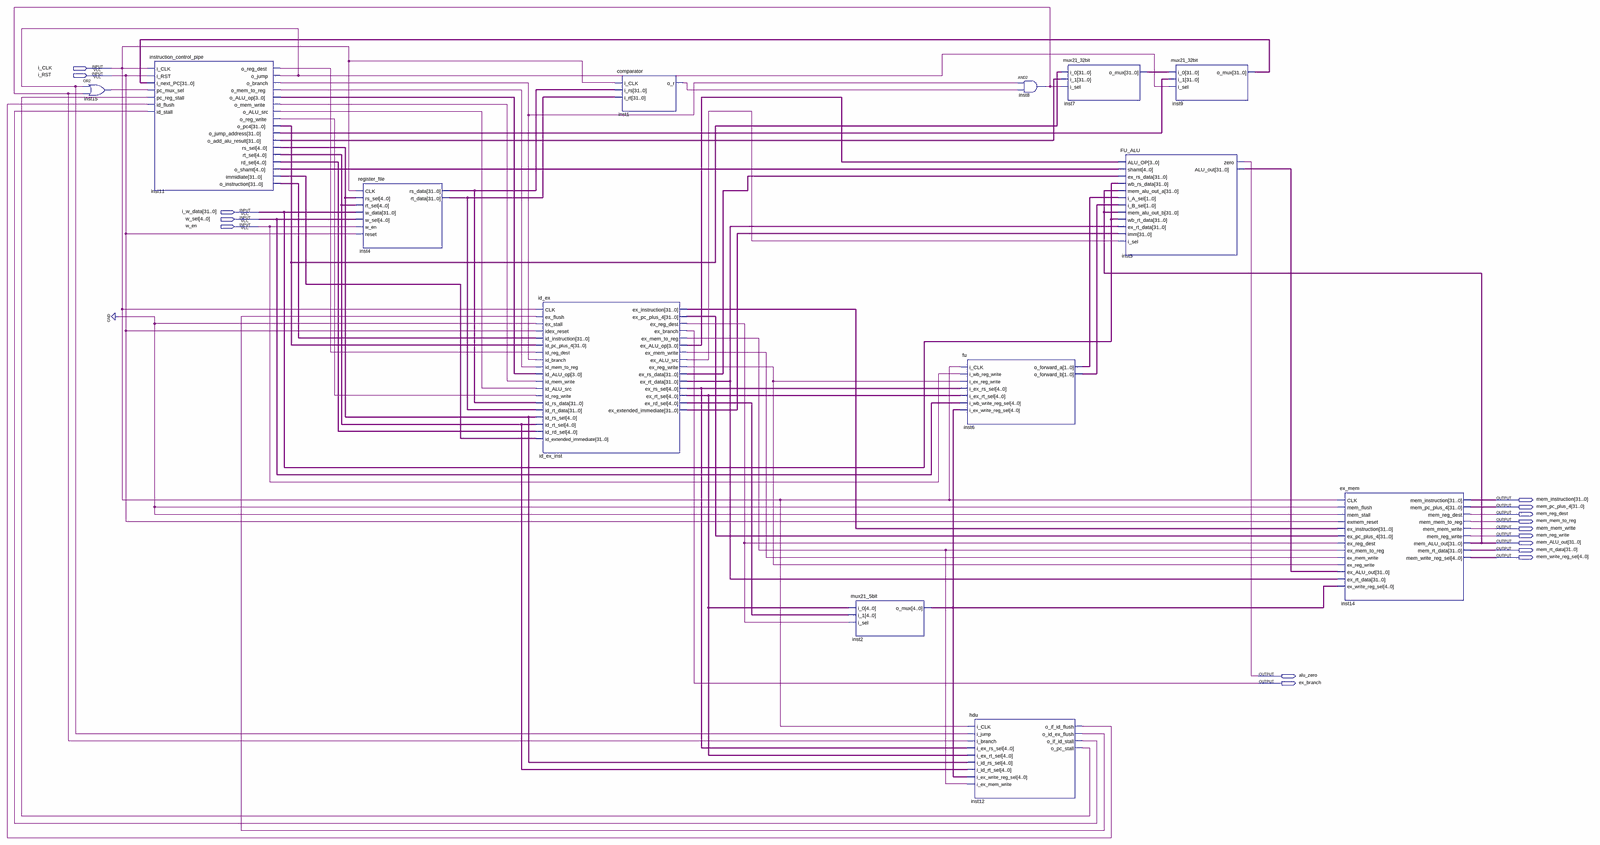
[diagram p0: schematic sheet, whole]
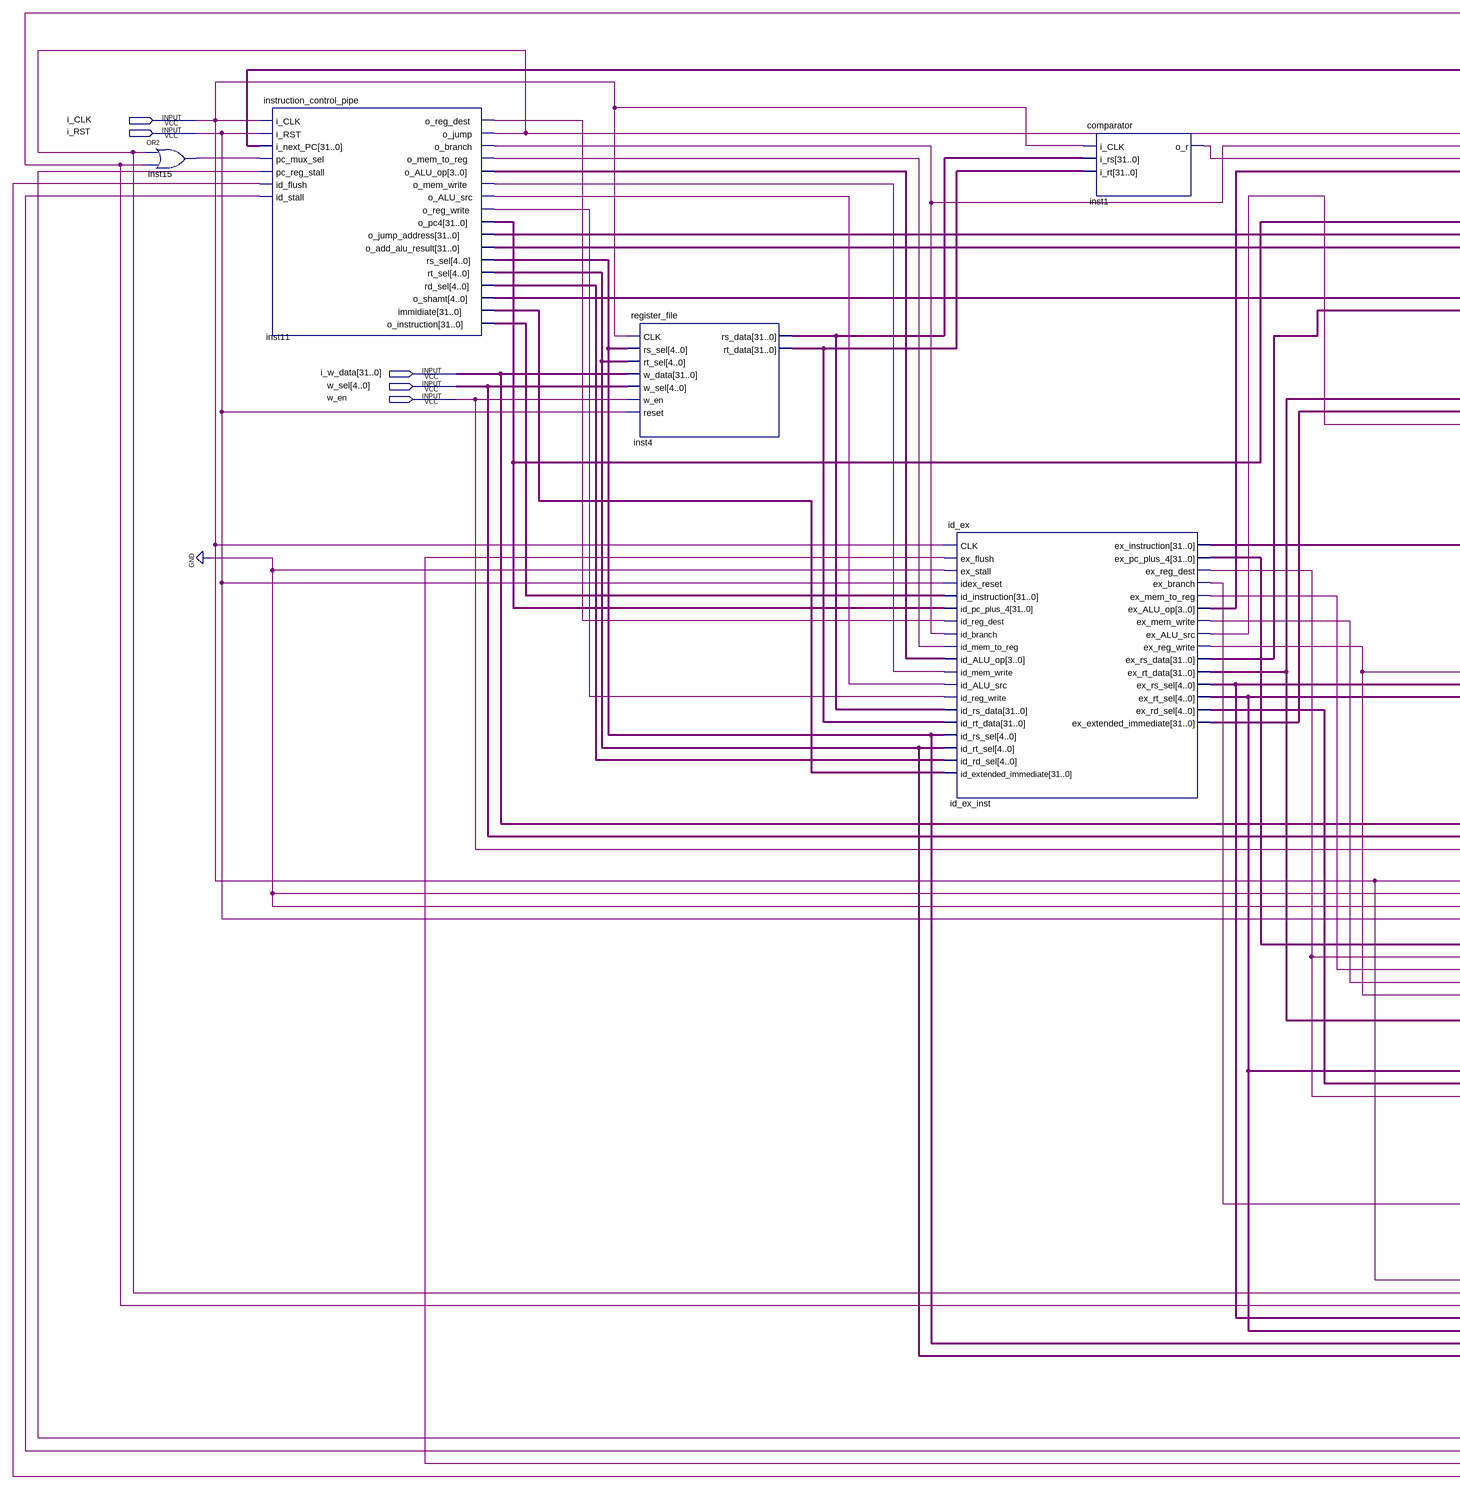
[diagram p1: schematic sheet, left part]
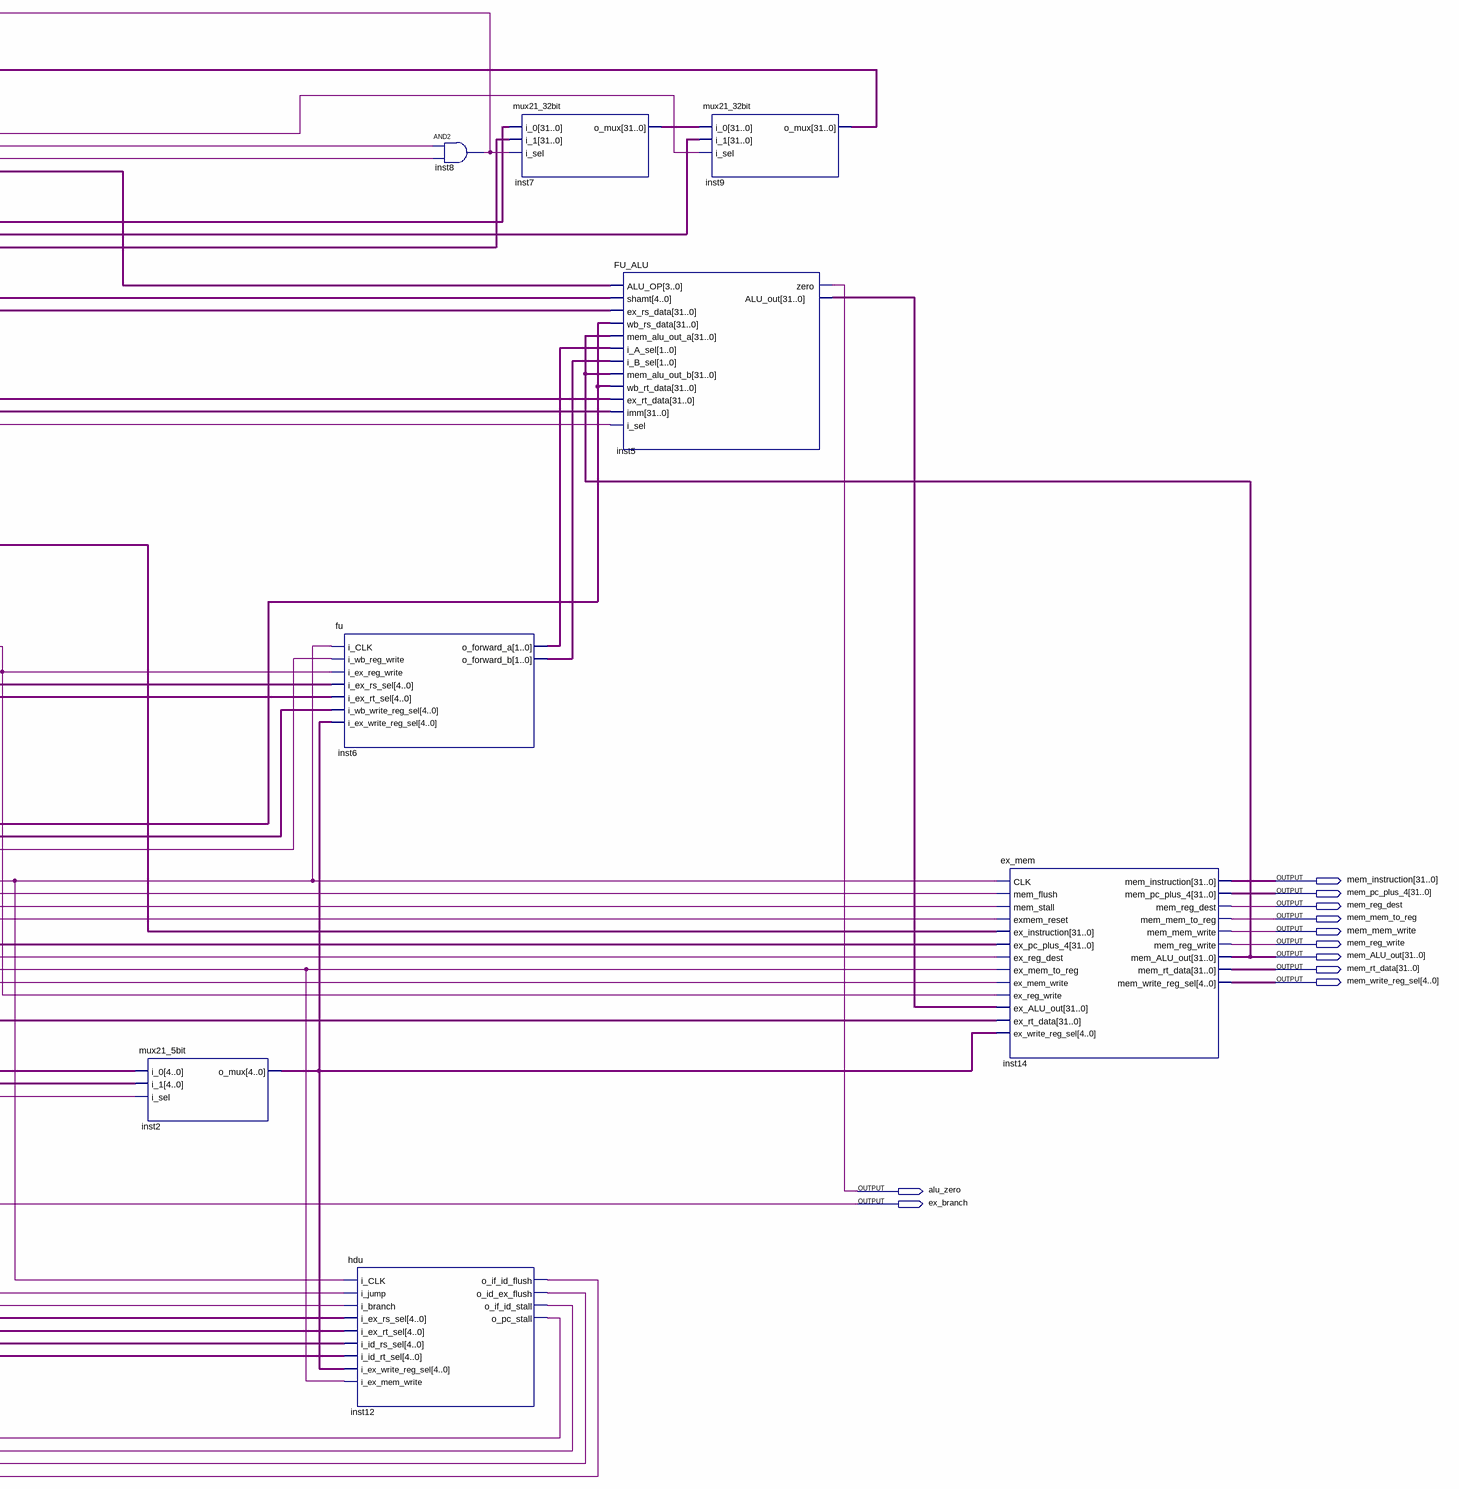
[diagram p2: schematic sheet, right part]
// Quartus schematic instruction_control_alu_pipe.bdf as structural Verilog: 13 symbols, 16 pins
module instruction_control_alu_pipe (
  input  i_CLK,
  input  i_RST,
  input  [31:0] i_w_data,
  input  [4:0] w_sel,
  input  w_en,
  output [31:0] mem_instruction,
  output [31:0] mem_pc_plus_4,
  output mem_reg_dest,
  output mem_mem_to_reg,
  output mem_mem_write,
  output mem_reg_write,
  output [31:0] mem_ALU_out,
  output [31:0] mem_rt_data,
  output [4:0] mem_write_reg_sel,
  output alu_zero,
  output ex_branch
);

  wire id_ex_inst_ex_alu_src, id_ex_inst_ex_mem_to_reg, id_ex_inst_ex_mem_write, id_ex_inst_ex_reg_dest,
       id_ex_inst_ex_reg_write, inst1_o_r, inst8_out, inst11_o_alu_src, inst11_o_branch, inst11_o_jump,
       inst11_o_mem_to_reg, inst11_o_mem_write, inst11_o_reg_dest, inst11_o_reg_write, inst12_o_id_ex_flush,
       inst12_o_if_id_flush, inst12_o_if_id_stall, inst12_o_pc_stall, inst15_out;
  wire [1:0] inst6_o_forward_a, inst6_o_forward_b;
  wire [3:0] id_ex_inst_ex_alu_op, inst11_o_alu_op;
  wire [4:0] id_ex_inst_ex_rd_sel, id_ex_inst_ex_rs_sel, id_ex_inst_ex_rt_sel, inst2_o_mux, inst11_o_shamt,
       inst11_rd_sel, inst11_rs_sel, inst11_rt_sel;
  wire [31:0] id_ex_inst_ex_extended_immediate, id_ex_inst_ex_instruction, id_ex_inst_ex_pc_plus_4,
       id_ex_inst_ex_rs_data, id_ex_inst_ex_rt_data, inst4_rs_data, inst4_rt_data, inst5_alu_out,
       inst7_o_mux, inst9_o_mux, inst11_immidiate, inst11_o_add_alu_result, inst11_o_instruction,
       inst11_o_jump_address, inst11_o_pc4;

  or inst15 (inst15_out, inst11_o_jump, inst8_out);
  instruction_control_pipe inst11 (
    .i_CLK(i_CLK), .i_RST(i_RST), .i_next_PC(inst9_o_mux), .pc_mux_sel(inst15_out),
    .pc_reg_stall(inst12_o_pc_stall), .id_flush(inst12_o_if_id_flush), .id_stall(inst12_o_if_id_stall),
    .o_reg_dest(inst11_o_reg_dest), .o_jump(inst11_o_jump), .o_branch(inst11_o_branch),
    .o_mem_to_reg(inst11_o_mem_to_reg), .o_ALU_op(inst11_o_alu_op), .o_mem_write(inst11_o_mem_write),
    .o_ALU_src(inst11_o_alu_src), .o_reg_write(inst11_o_reg_write), .o_pc4(inst11_o_pc4),
    .o_jump_address(inst11_o_jump_address), .o_add_alu_result(inst11_o_add_alu_result),
    .rs_sel(inst11_rs_sel), .rt_sel(inst11_rt_sel), .rd_sel(inst11_rd_sel), .o_shamt(inst11_o_shamt),
    .immidiate(inst11_immidiate), .o_instruction(inst11_o_instruction));
  register_file inst4 (
    .CLK(i_CLK), .rs_sel(inst11_rs_sel), .rt_sel(inst11_rt_sel), .w_data(i_w_data), .w_sel(w_sel),
    .w_en(w_en), .reset(i_RST), .rs_data(inst4_rs_data), .rt_data(inst4_rt_data));
  id_ex id_ex_inst (
    .CLK(i_CLK), .ex_flush(inst12_o_id_ex_flush), .ex_stall(1'b0), .idex_reset(i_RST),
    .id_instruction(inst11_o_instruction), .id_pc_plus_4(inst11_o_pc4), .id_reg_dest(inst11_o_reg_dest),
    .id_branch(inst11_o_branch), .id_mem_to_reg(inst11_o_mem_to_reg), .id_ALU_op(inst11_o_alu_op),
    .id_mem_write(inst11_o_mem_write), .id_ALU_src(inst11_o_alu_src), .id_reg_write(inst11_o_reg_write),
    .id_rs_data(inst4_rs_data), .id_rt_data(inst4_rt_data), .id_rs_sel(inst11_rs_sel),
    .id_rt_sel(inst11_rt_sel), .id_rd_sel(inst11_rd_sel), .id_extended_immediate(inst11_immidiate),
    .ex_instruction(id_ex_inst_ex_instruction), .ex_pc_plus_4(id_ex_inst_ex_pc_plus_4),
    .ex_reg_dest(id_ex_inst_ex_reg_dest), .ex_branch(ex_branch), .ex_mem_to_reg(id_ex_inst_ex_mem_to_reg),
    .ex_ALU_op(id_ex_inst_ex_alu_op), .ex_mem_write(id_ex_inst_ex_mem_write),
    .ex_ALU_src(id_ex_inst_ex_alu_src), .ex_reg_write(id_ex_inst_ex_reg_write),
    .ex_rs_data(id_ex_inst_ex_rs_data), .ex_rt_data(id_ex_inst_ex_rt_data), .ex_rs_sel(id_ex_inst_ex_rs_sel),
    .ex_rt_sel(id_ex_inst_ex_rt_sel), .ex_rd_sel(id_ex_inst_ex_rd_sel),
    .ex_extended_immediate(id_ex_inst_ex_extended_immediate));
  comparator inst1 (.i_CLK(i_CLK), .i_rs(inst4_rs_data), .i_rt(inst4_rt_data), .o_r(inst1_o_r));
  mux21_5bit inst2 (
    .i_0(id_ex_inst_ex_rt_sel), .i_1(id_ex_inst_ex_rd_sel), .i_sel(id_ex_inst_ex_reg_dest),
    .o_mux(inst2_o_mux));
  fu inst6 (
    .i_CLK(i_CLK), .i_wb_reg_write(w_en), .i_ex_reg_write(id_ex_inst_ex_reg_write),
    .i_ex_rs_sel(id_ex_inst_ex_rs_sel), .i_ex_rt_sel(id_ex_inst_ex_rt_sel), .i_wb_write_reg_sel(w_sel),
    .i_ex_write_reg_sel(inst2_o_mux), .o_forward_a(inst6_o_forward_a), .o_forward_b(inst6_o_forward_b));
  hdu inst12 (
    .i_CLK(i_CLK), .i_jump(inst11_o_jump), .i_branch(inst8_out), .i_ex_rs_sel(id_ex_inst_ex_rs_sel),
    .i_ex_rt_sel(id_ex_inst_ex_rt_sel), .i_id_rs_sel(inst11_rs_sel), .i_id_rt_sel(inst11_rt_sel),
    .i_ex_write_reg_sel(inst2_o_mux), .i_ex_mem_write(id_ex_inst_ex_mem_to_reg),
    .o_if_id_flush(inst12_o_if_id_flush), .o_id_ex_flush(inst12_o_id_ex_flush),
    .o_if_id_stall(inst12_o_if_id_stall), .o_pc_stall(inst12_o_pc_stall));
  and inst8 (inst8_out, inst11_o_branch, inst1_o_r);
  mux21_32bit inst7 (.i_0(inst11_o_pc4), .i_1(inst11_o_add_alu_result), .i_sel(inst8_out), .o_mux(inst7_o_mux));
  FU_ALU inst5 (
    .ALU_OP(id_ex_inst_ex_alu_op), .shamt(inst11_o_shamt), .ex_rs_data(id_ex_inst_ex_rs_data),
    .wb_rs_data(i_w_data), .mem_alu_out_a(mem_ALU_out), .i_A_sel(inst6_o_forward_a),
    .i_B_sel(inst6_o_forward_b), .mem_alu_out_b(mem_ALU_out), .wb_rt_data(i_w_data),
    .ex_rt_data(id_ex_inst_ex_rt_data), .imm(id_ex_inst_ex_extended_immediate),
    .i_sel(id_ex_inst_ex_alu_src), .zero(alu_zero), .ALU_out(inst5_alu_out));
  mux21_32bit inst9 (.i_0(inst7_o_mux), .i_1(inst11_o_jump_address), .i_sel(inst11_o_jump), .o_mux(inst9_o_mux));
  ex_mem inst14 (
    .CLK(i_CLK), .mem_flush(1'b0), .mem_stall(1'b0), .exmem_reset(i_RST),
    .ex_instruction(id_ex_inst_ex_instruction), .ex_pc_plus_4(id_ex_inst_ex_pc_plus_4),
    .ex_reg_dest(id_ex_inst_ex_reg_dest), .ex_mem_to_reg(id_ex_inst_ex_mem_to_reg),
    .ex_mem_write(id_ex_inst_ex_mem_write), .ex_reg_write(id_ex_inst_ex_reg_write),
    .ex_ALU_out(inst5_alu_out), .ex_rt_data(id_ex_inst_ex_rt_data), .ex_write_reg_sel(inst2_o_mux),
    .mem_instruction(mem_instruction), .mem_pc_plus_4(mem_pc_plus_4), .mem_reg_dest(mem_reg_dest),
    .mem_mem_to_reg(mem_mem_to_reg), .mem_mem_write(mem_mem_write), .mem_reg_write(mem_reg_write),
    .mem_ALU_out(mem_ALU_out), .mem_rt_data(mem_rt_data), .mem_write_reg_sel(mem_write_reg_sel));
endmodule
